# Altium schematic sheet STM32WL_MCU_IOs.SchDoc
size A4; SheetNumber: 1; SheetTotal: 5
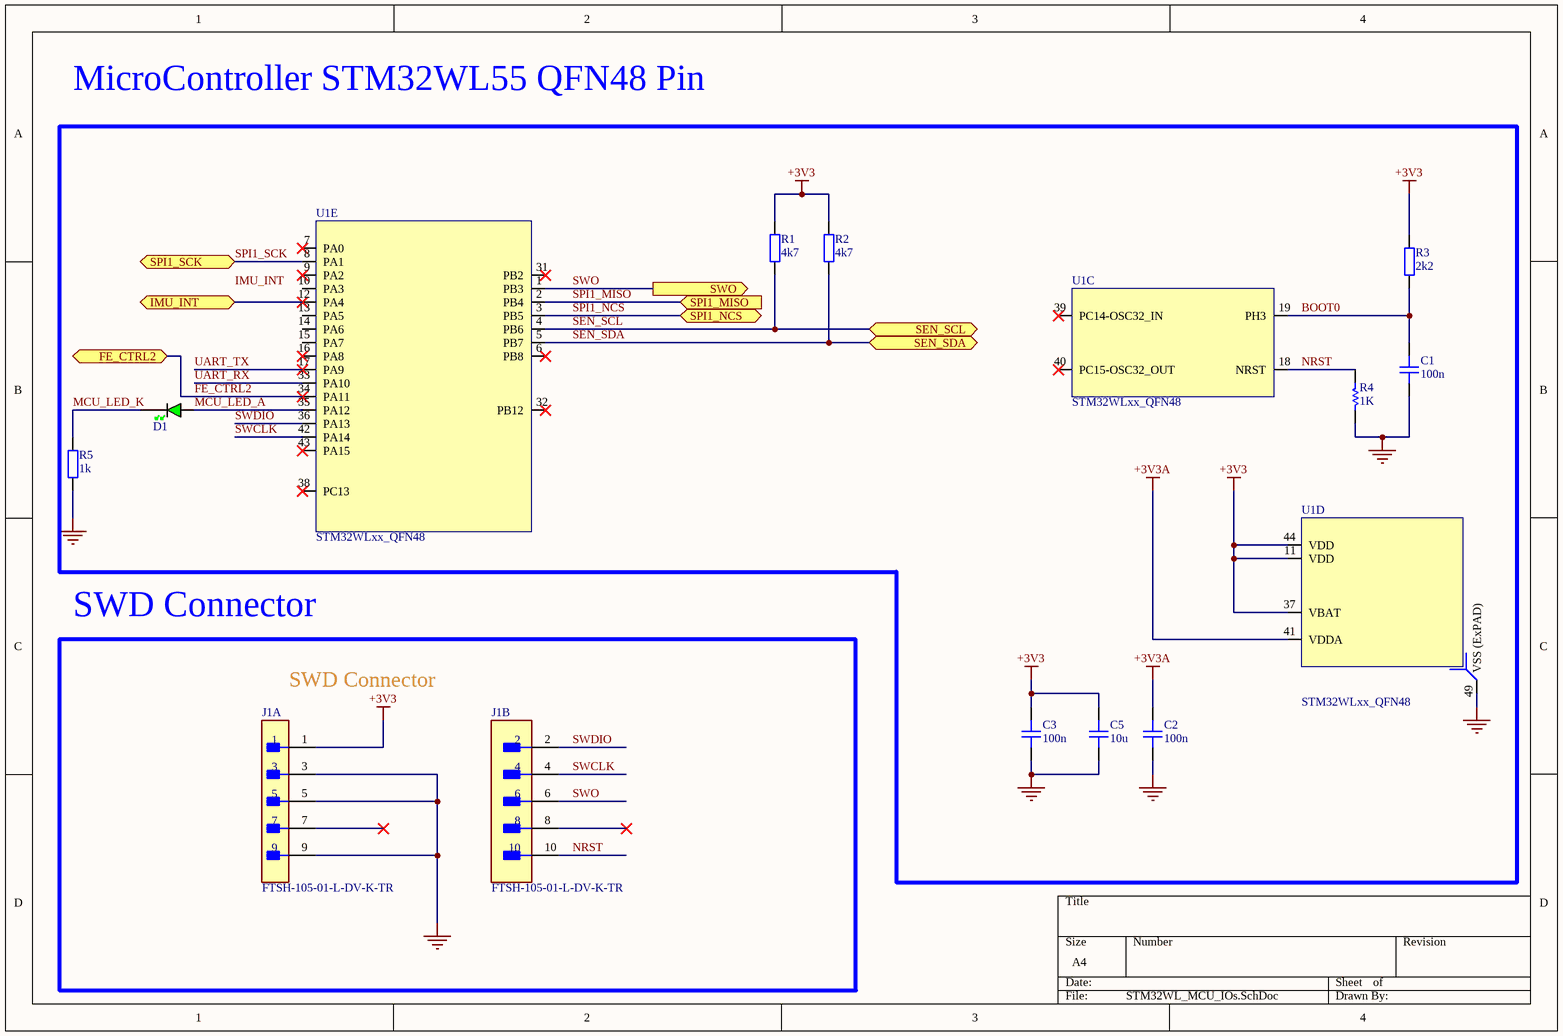
[diagram p0: STM32WL_MCU_IOs.SchDoc]

## Parts
C1  100n  [CAP_0603]
C2  100n  [CAP_0603]
C3  100n  [CAP_0603]
C5  10u  [CAP_0603]
D1  GREEN  [LED_0402_GREEN]  (value not drawn)
J1  FTSH-105-01-L-DV-K-TR  [FP-FTSH-105-01-L-DV-K-TR-MFG]  (parts A,B of 2)
R1  4k7  [RES_0603]
R2  4k7  [RES_0603]
R3  2k2  [RES_0402]
R4  value 1K  [RES_0603]
R5  1k  [RES_0402]
U1  STM32WLxx_QFN48  [STM32WLxx_QFN48]  (parts C,D,E of 5)

## Blocks framed on the sheet
SWD Connector: J1

## Ports
FE_CTRL2 (bidir, see STM32WL_RF[3A]), IMU_INT (bidir, see STM32WL_Sensors[2B]), SEN_SCL (bidir, see STM32WL_Sensors[1B]), SEN_SDA (bidir, see STM32WL_Sensors[1B]), SPI1_MISO (in, see STM32WL_ADC[3C]), SPI1_NCS (bidir, see STM32WL_ADC[2D]), SPI1_SCK (bidir, see STM32WL_ADC[2D]), SWO (out)

## Nets
+3V3: C3.2 C5.2 J1.1 R1.2 R2.2 R3.2 U1.11(VDD) U1.37(VBAT) U1.44(VDD)
+3V3A: C2.2 U1.41(VDDA)
GND: C1.1 C2.1 C3.1 C5.1 J1.3 J1.5 J1.9 R4.1 R5.1 U1.49(VSS_(ExPAD))
BOOT0: C1.2 R3.1 U1.19(PH3)
FE_CTRL2: U1.34(PA11) ; port FE_CTRL2
IMU_INT: U1.12(PA4) ; port IMU_INT
MCU_LED_A: D1.A U1.35(PA12)
MCU_LED_K: D1.K R5.2
NRST: J1.10 R4.2 U1.18(NRST)
SEN_SCL: R1.1 U1.4(PB6) ; port SEN_SCL
SEN_SDA: R2.1 U1.5(PB7) ; port SEN_SDA
SPI1_MISO: U1.2(PB4) ; port SPI1_MISO
SPI1_NCS: U1.3(PB5) ; port SPI1_NCS
SPI1_SCK: U1.8(PA1) ; port SPI1_SCK
SWCLK: J1.4 U1.42(PA14)
SWDIO: J1.2 U1.36(PA13)
SWO: J1.6 U1.1(PB3) ; port SWO
UART_RX: U1.33(PA10)
UART_TX: U1.17(PA9)

Not connected (* = marked no-connect by the designer): J1 7* 8*; U1 6(PB8)* 7(PA0)* 9(PA2)* 10(PA3) 13(PA5) 14(PA6) 15(PA7) 16(PA8)* 31(PB2)* 32(PB12)* 38(PC13)* 39(PC14-OSC32_IN)* 40(PC15-OSC32_OUT)* 43(PA15)*

## Notes on the sheet
- MicroController STM32WL55 QFN48 Pin
- SWD Connector
- Labels drawn without touching a wire or pin: IMU_INT

## Library data of the parts
C1 = CAP_0402_16V: Capacitor SMD 0402 16V; Parameter 1: *; Parameter 2: *
C2 C3 = CAP_0201_16V: Capacitor SMD 0201 16V
C5 = CAP_0603_16V: Capacitor SMD 0603 16V
D1 = LED_0402_GREEN: LED 0402 GREEN SMD
J1 = CMP-2000-06293-2: CONN HEADER SMD 10POS 1.27MM; Max Current Rating: 1.75A; Number of Contacts: 10; Gender: Male; Row Spacing: 0.05inch; Connector Type: Male Pin; Housing Color: Black; Min Operating Temperature: -55°C; Depth: 3.43mm; Color: Black; Contact Plating: Gold; REACH SVHC: No SVHC; Packaging: Tape and Reel; Current Rating: 1.75A; Radiation Hardening: No; Package Quantity: 550; Number of Positions: 10; Max Operating Temperature: 125°C; Orientation: Straight; Termination: Solder; Contact Mating Length: 0.12inch; Number of Rows: 2; Lead Free: Lead Free; Contact Material: Bronze; Mount: Surface Mount; Housing Material: Polymer; Pitch: 1.27mm; Length: 6.35mm
R1 R2 = RES_0603: Resistor SMD 0603
R3 R5 = RES_0402: Resistor SMD 0402
R4 = MCD-00061: Resistor,1K,0402,1%,1/16W; Manufacturer_Part_Number: RC0402FR-071KL; Manufacturer: YAGEO; Provided_By: SUBCO; ECCN_US: EAR99; ECCN_EU: NEC; Internal_Part_Number: MCD-00061; Status: Released; Part_Type: Resistor; Package: R0402; ComponentLink1Description: Datasheet; ComponentLink1URL: http://tunmcdsvn.tun.st.com/Component_Datasheet_Library/Trunk/Resistors/Yageo_Resistor_RC0402-series
U1 = STM32WLxx_QFN48: HQDC : Verified April, 25 2019; Manufacturer: STMicroelectronics; Manufacturer_Part_Number: STM32WLE5CC